# Altium schematic sheet CAN.SchDoc
size A4; Organization: Altium Limited; Address1: L3, 12a Rodborough Rd; Address2: Frenchs Forest; Address3: NSW; Address4: Australia 2086; SheetNumber: 4
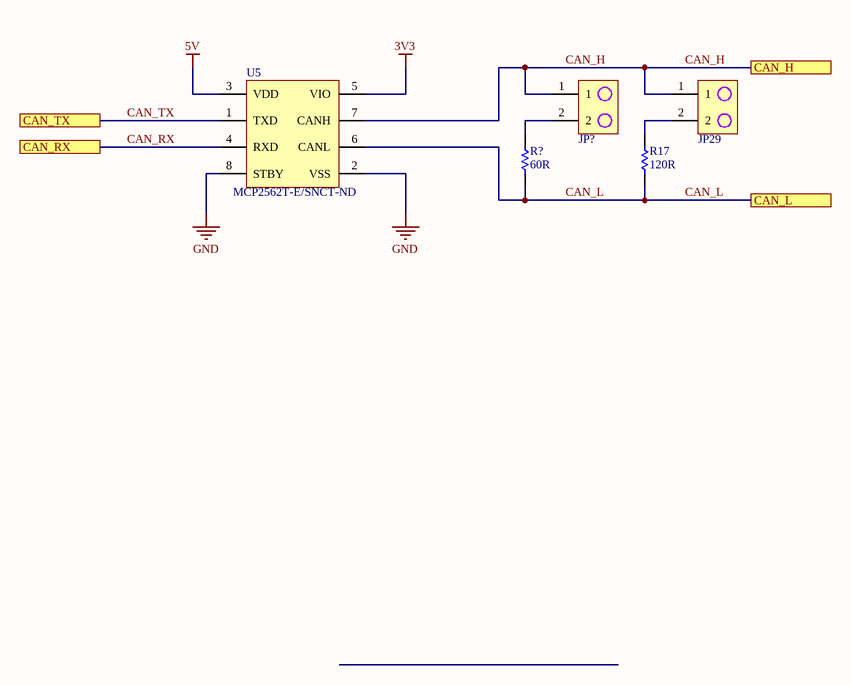
[diagram p0: CAN.SchDoc]

## Parts
JP29  732-5315-ND  [2PIN-JP]  (value not drawn)
JP?  732-5315-ND  [2PIN-JP]  (value not drawn)
R17  120R  [RES-0603]
R?  60R  [RES-0603]
U5  MCP2562T-E/SNCT-ND  [8-SOIC w/o THRM]

## Ports
CAN_H, CAN_L, CAN_RX, CAN_TX

## Nets
3V3: U5.5(VIO)
5V: U5.3(VDD)
GND: U5.2(VSS) U5.8(STBY)
CAN_H: JP29.1 JP?.1 U5.7(CANH) ; port CAN_H
CAN_L: R17.1 R?.1 U5.6(CANL) ; port CAN_L
CAN_RX: U5.4(RXD) ; port CAN_RX
CAN_TX: U5.1(TXD) ; port CAN_TX
NetJP29_2: JP29.2 R17.2
NetJP?_2: JP?.2 R?.2

## Notes on the sheet
- Title
- Size:
- Date:
- Tabloid
- Number:
- Time:
- Revision:
- Sheet
- of
- File:

## Library data of the parts
JP29 JP? = 2PIN-TEST: CONN HEADER VERT 2POS 2.54MM
R17 = 0603-120R: RES SMD 120 OHM 1% 1/10W 0603; Manufacturer: Yageo; Manufacturer Part Number: RC0603FR-07120RL; Voltage Rating (DC): 50V; Temperature Coefficient: 100ppm/°C; Power Rating: 100mW; Supplier 1: Digi-Key; Stock 1: 1047274; Pricing 1: 1=0.1, 10=0.023, 100=0.0094, 1000=0.00421, 2500=0.00366 (USD); Case/Package: 0603; Number of Pins: 2; Case Code (Metric): 1608; Case Code (Imperial): 0603; Min Operating Temperature: -55°C; Max Operating Temperature: 155°C; Resistance: 120R; Tolerance: 1%; Packaging: Tape and Reel; Composition: Thick Film; Voltage Rating: 50V; Package Quantity: 1; Number of Terminations: 2; Termination: SMD/SMT; Military Standard: Not; Max Power Dissipation: 100mW; Features: Moisture Resistant; Length: 1.6mm; Height: 0.022inch; Width: 0.031inch; Depth: 0.8mm; REACH SVHC: No SVHC; Lead Free: Lead Free; ComponentLink1URL: http://www.yageo.com/documents/recent/PYu-RC_Group_51_RoHS_L_10.pdf?src-supplier=Digi-Key; ComponentLink1Description: http://www.yageo.com/documents/recent/PYu-RC_Group_51_RoHS_L_10.pdf?src-supplier=Digi-Key; ComponentLink2URL: http://www.farnell.com/datasheets/2167052.pdf?src-supplier=Element14; ComponentLink2Description: http://www.farnell.com/datasheets/2167052.pdf?src-supplier=Element14; ComponentLink3URL: http://www.farnell.com/datasheets/1868787.pdf?src-supplier=Element14; ComponentLink3Description: http://www.farnell.com/datasheets/1868787.pdf?src-supplier=Element14; ComponentLink4URL: http://www.farnell.com/datasheets/443971.pdf?src-supplier=Element14; ComponentLink4Description: http://www.farnell.com/datasheets/443971.pdf?src-supplier=Element14; Supplier Part Number 1: 311-120HRDKR-ND
R? = 0603-120R: RES SMD 120 OHM 1% 1/10W 0603; Manufacturer: Yageo; Manufacturer Part Number: RC0603FR-07120RL; Resistance: 120R; Voltage Rating (DC): 50V; Temperature Coefficient: 100ppm/°C; Power Rating: 100mW; Supplier 1: Digi-Key; Stock 1: 1047274; Pricing 1: 1=0.1, 10=0.023, 100=0.0094, 1000=0.00421, 2500=0.00366 (USD); Case/Package: 0603; Number of Pins: 2; Case Code (Metric): 1608; Case Code (Imperial): 0603; Min Operating Temperature: -55°C; Max Operating Temperature: 155°C; Tolerance: 1%; Packaging: Tape and Reel; Composition: Thick Film; Voltage Rating: 50V; Package Quantity: 1; Number of Terminations: 2; Termination: SMD/SMT; Military Standard: Not; Max Power Dissipation: 100mW; Features: Moisture Resistant; Length: 1.6mm; Height: 0.022inch; Width: 0.031inch; Depth: 0.8mm; REACH SVHC: No SVHC; Lead Free: Lead Free; ComponentLink1URL: http://www.yageo.com/documents/recent/PYu-RC_Group_51_RoHS_L_10.pdf?src-supplier=Digi-Key; ComponentLink1Description: http://www.yageo.com/documents/recent/PYu-RC_Group_51_RoHS_L_10.pdf?src-supplier=Digi-Key; ComponentLink2URL: http://www.farnell.com/datasheets/2167052.pdf?src-supplier=Element14; ComponentLink2Description: http://www.farnell.com/datasheets/2167052.pdf?src-supplier=Element14; ComponentLink3URL: http://www.farnell.com/datasheets/1868787.pdf?src-supplier=Element14; ComponentLink3Description: http://www.farnell.com/datasheets/1868787.pdf?src-supplier=Element14; ComponentLink4URL: http://www.farnell.com/datasheets/443971.pdf?src-supplier=Element14; ComponentLink4Description: http://www.farnell.com/datasheets/443971.pdf?src-supplier=Element14; Supplier Part Number 1: 311-120HRDKR-ND
U5 = CAN TRAN-MCP2562T-E/SN: IC TRANSCEIVER HALF 1/1 8SOIC; Manufacturer: Microchip; Propagation Delay: 125ns; Data Rate: 1Mbps; Nominal Supply Current: 85uA; Max Supply Voltage: 5.5V; Min Supply Voltage: 4.5V; Number of Transceivers: 1; Receiver Hysteresis: 200mV; Supplier 1: Digi-Key; Manufacturer Part Number: MCP2562T-E/SN; Stock 1: 0; Pricing 1: 1=0.9, 25=0.75, 100=0.68 (USD); Mount: Surface Mount; Case/Package: SOIC; Number of Pins: 8; Min Operating Temperature: -40°C; Max Operating Temperature: 125°C; Packaging: Tape and Reel; Package Quantity: 3300; Turn-On Delay Time: 125ns; Radiation Hardening: No; Lead Free: Lead Free; ComponentLink1URL: http://ww1.microchip.com/downloads/en/DeviceDoc/25167B.pdf?src-supplier=Digi-Key; ComponentLink1Description: http://ww1.microchip.com/downloads/en/DeviceDoc/25167B.pdf?src-supplier=Digi-Key; ComponentLink2URL: http://ww1.microchip.com/downloads/en/DeviceDoc/25167B.pdf?src-supplier=Avnet; ComponentLink2Description: http://ww1.microchip.com/downloads/en/DeviceDoc/25167B.pdf?src-supplier=Avnet; Supplier Part Number 1: MCP2562T-E/SNDKR-ND